# EAGLE schematic twpc (EAGLE 6.6.0)
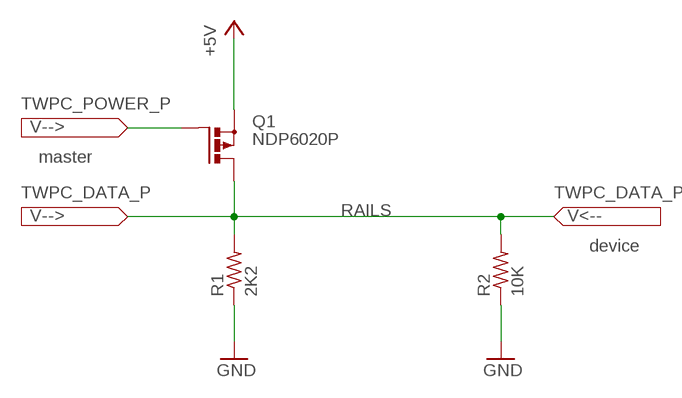
[diagram p0: schematic, sheet 1]

## Parts
Q1  NDP6020P  PMOSFET_PTO220BH  [TO220BH]
R1  2K2  R-US_0204/5  [0204/5]
R2  10K  R-US_0204/2V  [0204V]

## Nets
+5V: Q1.S
GND: R1.1 R2.1
N$1: Q1.G
N$2: Q1.D R1.2 R2.2

## Notes on the sheet
- TWPC_POWER_P
- master
- TWPC_DATA_P | TWPC_DATA_P
- RAILS
- device

## Library data of the parts
Q1 = transistor-power:PMOSFET_P: Power MOSFET P-Channel
R1 R2 = resistor:R-US_: RESISTOR, American symbol